# Altium schematic sheet ch559.SchDoc
size A3
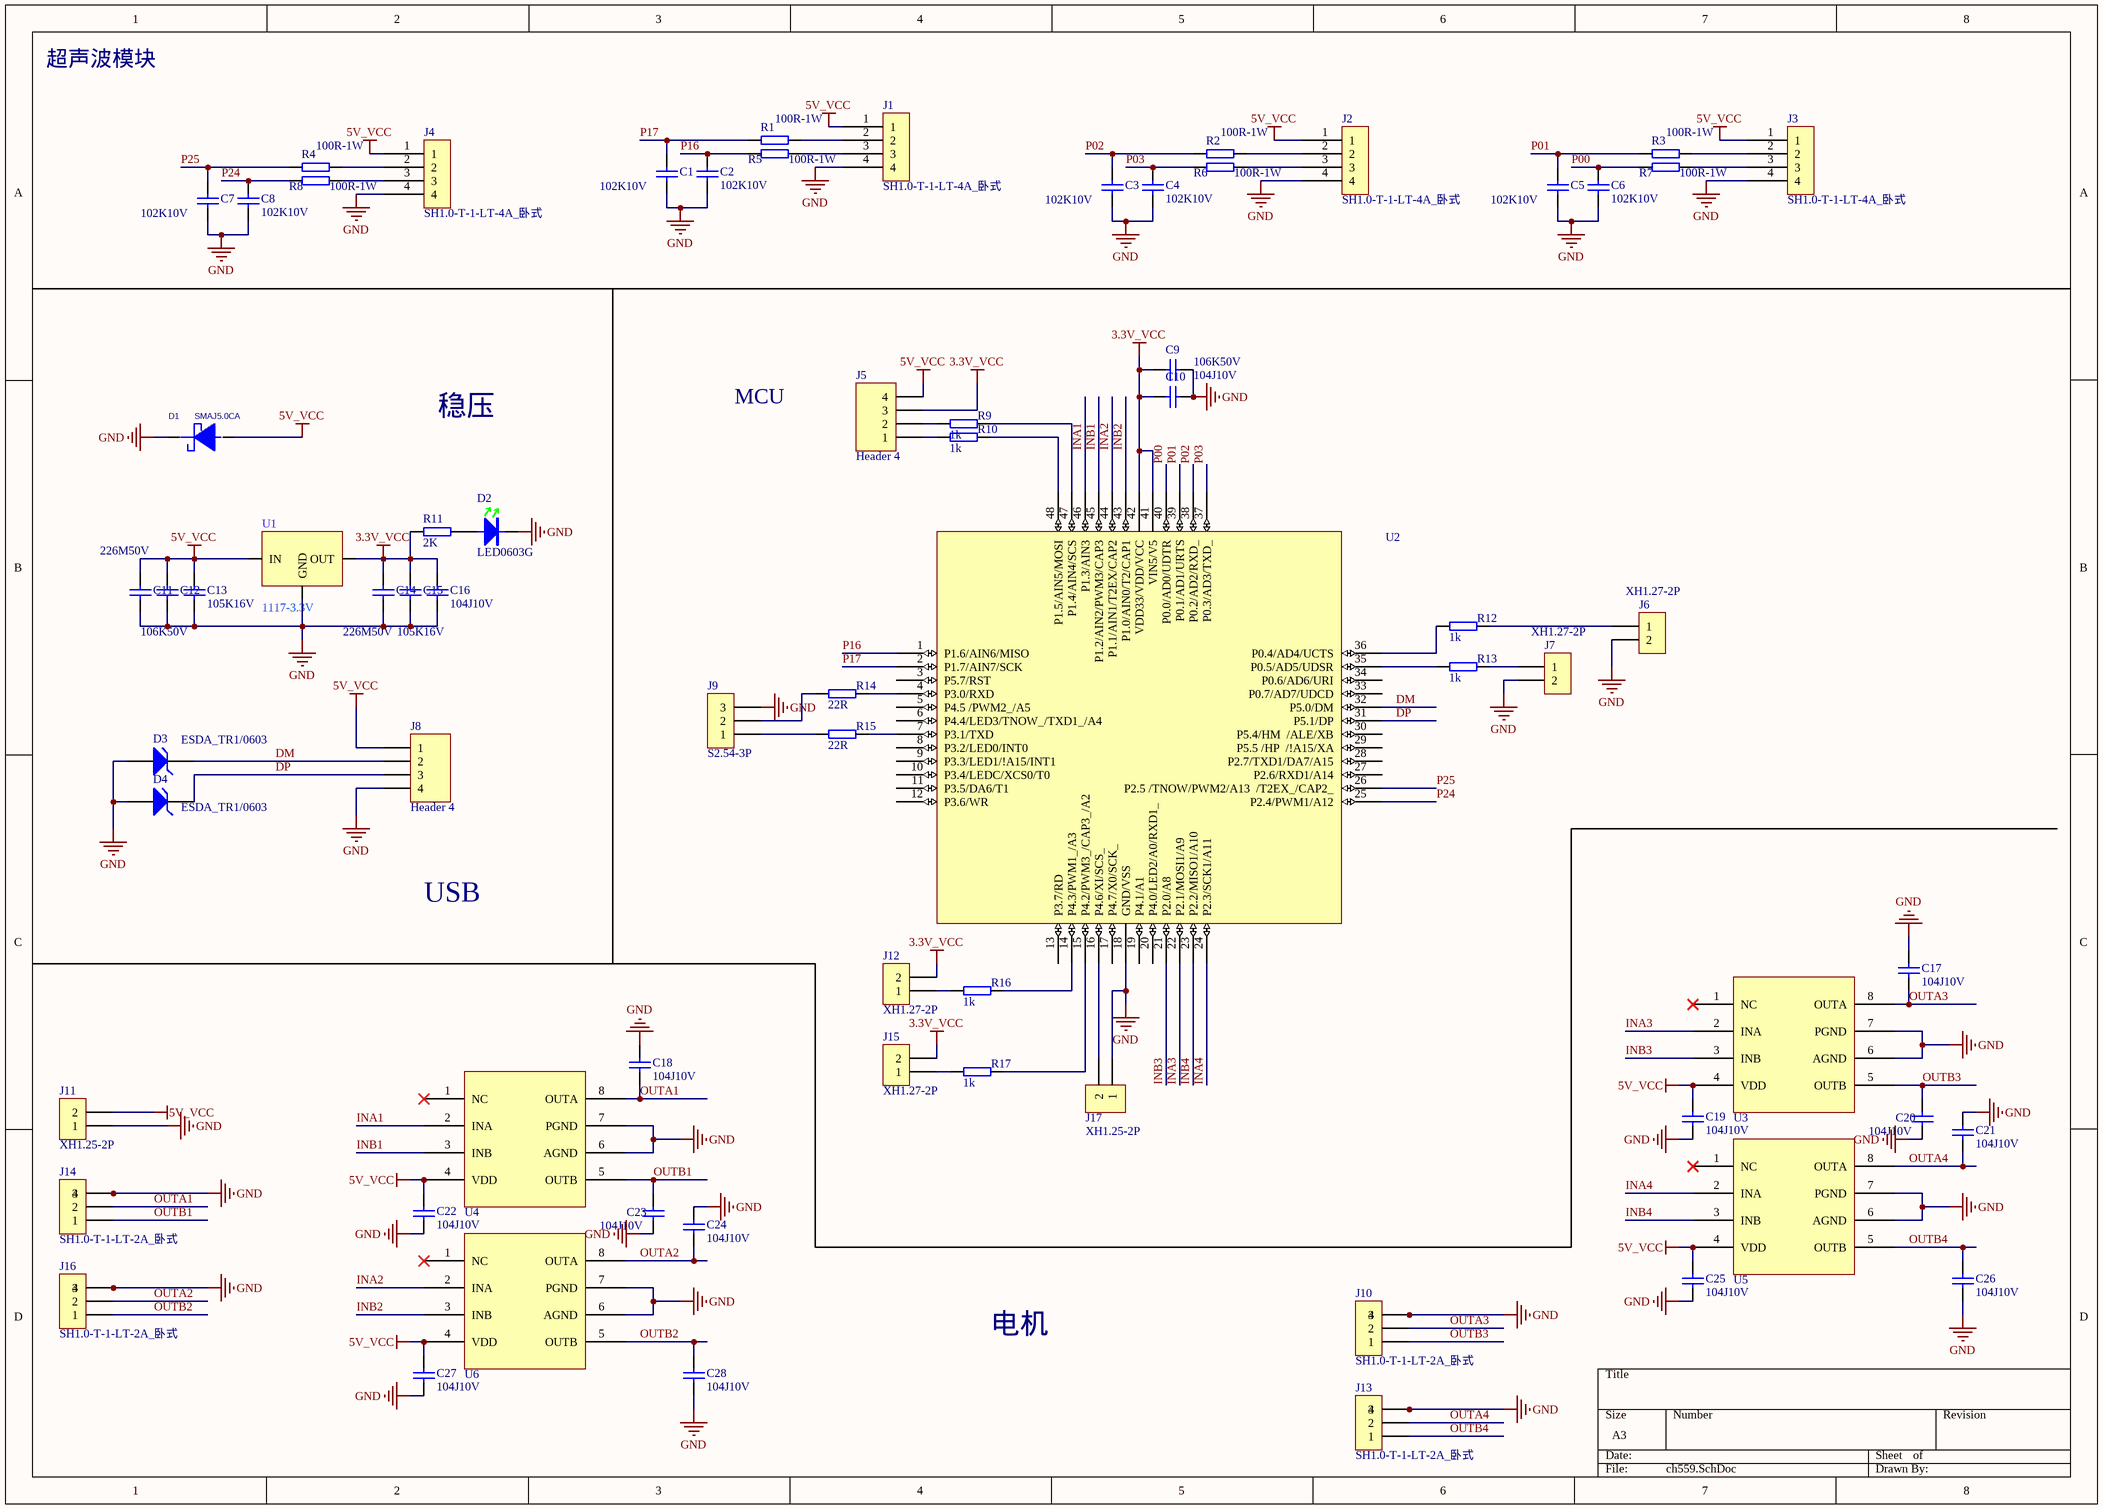
[diagram p0: ch559.SchDoc]

## Parts
C1  102K10V  [C0603]
C2  102K10V  [C0603]
C3  102K10V  [C0603]
C4  102K10V  [C0603]
C5  102K10V  [C0603]
C6  102K10V  [C0603]
C7  102K10V  [C0603]
C8  102K10V  [C0603]
C9  106K50V  [C0603]
C10  104J10V  [C0402]
C11  226M50V  [C0805]
C12  106K50V  [C0603]
C13  105K16V  [C0603]
C14  226M50V  [C0805]
C15  105K16V  [C0603]
C16  104J10V  [C0402]
C17  104J10V  [C0402]
C18  104J10V  [C0402]
C19  104J10V  [C0402]
C20  104J10V  [C0402]
C21  104J10V  [C0402]
C22  104J10V  [C0402]
C23  104J10V  [C0402]
C24  104J10V  [C0402]
C25  104J10V  [C0402]
C26  104J10V  [C0402]
C27  104J10V  [C0402]
C28  104J10V  [C0402]
D1  SMAJ5.0CA  [DO-214]
D2  LED0603G  [D-LED0603G]
D3  ESDA_TR1/0603  [HS_0603D]
D4  ESDA_TR1/0603  [HS_0603D]
J1  SH1.0-T-1-LT-4A_卧式  [XH2.54-4P]
J2  SH1.0-T-1-LT-4A_卧式  [XH2.54-4P]
J3  SH1.0-T-1-LT-4A_卧式  [XH2.54-4P]
J4  SH1.0-T-1-LT-4A_卧式  [XH2.54-4P]
J5  Header 4  [J-SH1.27 -4]
J6  XH1.27-2P  [J-SH1.27-2]
J7  XH1.27-2P  [J-SH1.27-2]
J8  Header 4  [XH2.54-4P]
J9  S2.54-3P  [S2.54-3P]
J10  SH1.0-T-1-LT-2A_卧式  [J-SH2.0-T-1-LT-2A_立式]
J11  XH1.25-2P  [XH2.54-2p]
J12  XH1.27-2P  [J-SH1.27-2]
J13  SH1.0-T-1-LT-2A_卧式  [J-SH2.0-T-1-LT-2A_立式]
J14  SH1.0-T-1-LT-2A_卧式  [J-SH2.0-T-1-LT-2A_立式]
J15  XH1.27-2P  [J-SH1.27-2]
J16  SH1.0-T-1-LT-2A_卧式  [J-SH2.0-T-1-LT-2A_立式]
J17  XH1.25-2P  [S1.25-2P]
R1  100R-1W  [R0603]
R2  100R-1W  [R0603]
R3  100R-1W  [R0603]
R4  100R-1W  [R0603]
R5  100R-1W  [R0603]
R6  100R-1W  [R0603]
R7  100R-1W  [R0603]
R8  100R-1W  [R0603]
R9  1k  [R0603]
R10  1k  [R0603]
R11  2K  [R0603]
R12  1k  [R0603]
R13  1k  [R0603]
R14  22R  [R0603]
R15  22R  [R0603]
R16  1k  [R0603]
R17  1k  [R0603]
U1  1117-3.3V  [SOT-223]
U2  CH559L  [LQFP48]  (value not drawn)
U3  PTC918  [SO-8]  (value not drawn)
U4  PTC918  [SO-8]  (value not drawn)
U5  PTC918  [SO-8]  (value not drawn)
U6  PTC918  [SO-8]  (value not drawn)

## Nets
3.3V_VCC: C9.2 C10.2 C14.1 C15.2 C16.1 J5.3 J12.2 J15.2 R11.2 U1.2(OUT) U2.41(VIN5/V5) U2.42(VDD33/VDD/VCC)
5V_VCC: C11.1 C12.1 C13.1 C19.1 C22.1 C25.1 C27.1 D1.1(+) J1.1 J2.1 J3.1 J4.1 J5.4 J8.1 J11.2 U1.3(IN) U3.4(VDD) U4.4(VDD) U5.4(VDD) U6.4(VDD)
GND: C1.2 C2.2 C3.2 C4.2 C5.2 C6.2 C7.2 C8.2 C9.1 C10.1 C11.2 C12.2 C13.2 C14.2 C15.1 C16.2 C17.1 C18.1 C19.2 C20.2 C21.1 C22.2 C23.2 C24.1 C25.2 C26.2 C27.2 C28.2 D1.2(-) D2.2 D3.1(A) D4.1(A) J1.4 J2.4 J3.4 J4.4 J6.2 J7.2 J8.4 J9.3 J10.3 J10.4 J11.1 J13.3 J13.4 J14.3 J14.4 J16.3 J16.4 J17.1 U1.1(GND) U2.18(GND/VSS) U3.6(AGND) U3.7(PGND) U4.6(AGND) U4.7(PGND) U5.6(AGND) U5.7(PGND) U6.6(AGND) U6.7(PGND)
DM: D3.2(K) J8.2 U2.32(P5.0/DM)
DP: D4.2(K) J8.3 U2.31(P5.1/DP)
INA1: U2.46(P1.3/AIN3) U4.2(INA)
INA2: U2.44(P1.1/AIN1/T2EX/CAP2) U6.2(INA)
INA3: U2.22(P2.1/MOSI1/A9) U3.2(INA)
INA4: U2.24(P2.3/SCK1/A11) U5.2(INA)
INB1: U2.45(P1.2/AIN2/PWM3/CAP3) U4.3(INB)
INB2: U2.43(P1.0/AIN0/T2/CAP1) U6.3(INB)
INB3: U2.21(P2.0/A8) U3.3(INB)
INB4: U2.23(P2.2/MISO1/A10) U5.3(INB)
OUTA1: C18.2 J14.2 U4.8(OUTA)
OUTA2: C24.2 J16.2 U6.8(OUTA)
OUTA3: C17.2 J10.2 U3.8(OUTA)
OUTA4: C21.2 J13.2 U5.8(OUTA)
OUTB1: C23.1 J14.1 U4.5(OUTB)
OUTB2: C28.1 J16.1 U6.5(OUTB)
OUTB3: C20.1 J10.1 U3.5(OUTB)
OUTB4: C26.1 J13.1 U5.5(OUTB)
P00: C6.1 R7.1 U2.40(P0.0/AD0/UDTR)
P01: C5.1 R3.1 U2.39(P0.1/AD1/URTS)
P02: C3.1 R2.1 U2.38(P0.2/AD2/RXD_)
P03: C4.1 R6.1 U2.37(P0.3/AD3/TXD_)
P16: C2.1 R5.1 U2.1(P1.6/AIN6/MISO)
P17: C1.1 R1.1 U2.2(P1.7/AIN7/SCK)
P24: C8.1 R8.1 U2.25(P2.4/PWM1/A12)
P25: C7.1 R4.1 U2.26(P2.5_/TNOW/PWM2/A13__/T2EX_/CAP2_)
NetD2_1: D2.1 R11.1
NetJ1_2: J1.2 R1.2
NetJ1_3: J1.3 R5.2
NetJ2_2: J2.2 R2.2
NetJ2_3: J2.3 R6.2
NetJ3_2: J3.2 R3.2
NetJ3_3: J3.3 R7.2
NetJ4_2: J4.2 R4.2
NetJ4_3: J4.3 R8.2
NetJ5_1: J5.1 R10.1
NetJ5_2: J5.2 R9.1
NetJ6_1: J6.1 R12.2
NetJ7_1: J7.1 R13.2
NetJ9_1: J9.1 R15.1
NetJ9_2: J9.2 R14.1
NetJ12_1: J12.1 R16.1
NetJ15_1: J15.1 R17.1
NetJ17_2: J17.2 U2.16(P4.6/XI/SCS_)
NetR9_2: R9.2 U2.47(P1.4/AIN4/SCS)
NetR10_2: R10.2 U2.48(P1.5/AIN5/MOSI)
NetR12_1: R12.1 U2.36(P0.4/AD4/UCTS)
NetR13_1: R13.1 U2.35(P0.5/AD5/UDSR)
NetR14_2: R14.2 U2.4(P3.0/RXD)
NetR15_2: R15.2 U2.7(P3.1/TXD)
NetR16_2: R16.2 U2.14(P4.3/PWM1_/A3)
NetR17_2: R17.2 U2.15(P4.2/PWM3_/CAP3_/A2)

Not connected (* = marked no-connect by the designer): U2 3(P5.7/RST) 5(P4.5_/PWM2_/A5) 6(P4.4/LED3/TNOW_/TXD1_/A4) 8(P3.2/LED0/INT0) 9(P3.3/LED1/!A15/INT1) 10(P3.4/LEDC/XCS0/T0) 11(P3.5/DA6/T1) 12(P3.6/WR) 13(P3.7/RD) 17(P4.7/X0/SCK_) 19(P4.1/A1) 20(P4.0/LED2/A0/RXD1_) 27(P2.6/RXD1/A14) 28(P2.7/TXD1/DA7/A15) 29(P5.5_/HP__/!A15/XA) 30(P5.4/HM__/ALE/XB) 33(P0.7/AD7/UDCD) 34(P0.6/AD6/URI); U3 1(NC)*; U4 1(NC)*; U5 1(NC)*; U6 1(NC)*

## Notes on the sheet
- 超声波模块
- 稳压
- MCU
- USB
- 电机

## Library data of the parts
C1-C8 = C0603X7R-102K10V: 贴片电容-陶瓷
C9 C12 = C0603X7R-106K50V: 贴片电容-陶瓷; 规格型号: 10uF±10%_50V_X7R_C0603; 生产商: 风华 三星; 供应商: *; 备注: *
C10 C16-C28 = C0402X7R-104J10V: 贴片电容-陶瓷; 规格型号: 100nF±5%_10V_X7R_C0402; 生产商: 风华 三星; 供应商: *; 备注: *
C11 C14 = C0805Y5V-226M50V: 贴片电容-陶瓷; 规格型号: 22uF±20%_50V_Y5V_C0805; 生产商: 风华 三星; 供应商: *; 备注: *
C13 C15 = C0603X7R-105K16V: 贴片电容-陶瓷; 规格型号: 1uF±10%_16V_X7R_C0603; 生产商: 风华 三星; 供应商: *; 备注: *
D2 = DLED-0603-G: 贴片二极管-LED; 规格型号: 0603-GREEN; 货品编码: 无样品无编码; 生产商: *; 供应商: *; 备注: *
D3 D4 = D Zener: Zener Diode; Published: *; LatestRevisionDate: *; LatestRevisionNote: *; PackageReference: *; Publisher: *
J5 J8 = Header 4: Header, 4-Pin; LatestRevisionDate: 17-Jul-2002; LatestRevisionNote: Re-released for DXP Platform.; Publisher: Altium Limited
J6 J7 J12 J15 = J-XH1.27-2P: 接插件-1.27; 规格型号: XH2.54-2P; 货品编码: 371007; 供应商: *; 备注: *
J9 = J-S2.54-3P: 单排排针-直针; 货品编码: 372015; 供应商: *; 规格型号: S2.54-3P; 备注: *
J11 = J-XH2.54-2P_1: 接插件-2.54; 货品编码: 371007; 供应商: *; 规格型号: XH2.54-2P; 备注: *
J17 = J-XH2.54-2P: 接插件-2.54; 货品编码: 371007; 供应商: *; 规格型号: XH2.54-2P; 备注: *
R1-R8 = R1-100R: 插件电阻-碳膜; 生产商: 厚声 国巨; 规格型号: 100R±5%_1W_±100ppm_AXIAL0.6; 货品编码: 312145; 备注: *; 供应商: *
R9-R17 = R0603-100RF: 贴片电阻-通用; 生产商: 厚声 国巨; 规格型号: 100R±1%_1/10W_±200ppm_R0603; 备注: *; 供应商: *
U1 = AP1117-33 SOT-223: 芯片 电源类; 单价: 0.15
U2 = CH559L: 单片机
U3-U6 = PTC918: 马达驱动芯片
D1 = SMAJ5.0CA: PCB DECAL: DO-214; Value: SMAJ5.0CA